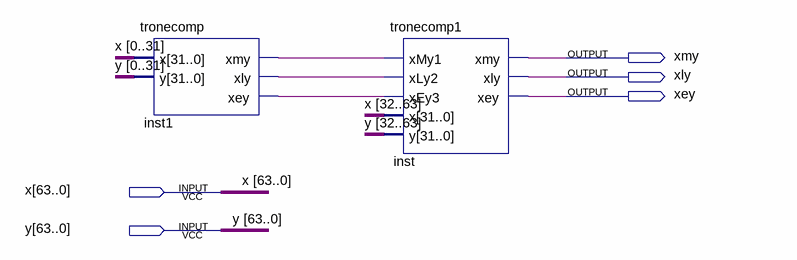
[diagram p0: schematic sheet]
// Quartus schematic hestcetcomp.bdf as structural Verilog: 2 symbols, 5 pins
module hestcetcomp (
  input  [63:0] x,
  input  [63:0] y,
  output xmy,
  output xly,
  output xey
);

  wire inst1_xey, inst1_xly, inst1_xmy;

  tronecomp inst1 (
    .x({x[0], x[1], x[2], x[3], x[4], x[5], x[6], x[7], x[8], x[9], x[10], x[11], x[12], x[13], x[14], x[15], x[16], x[17], x[18], x[19], x[20], x[21], x[22], x[23], x[24], x[25], x[26], x[27], x[28], x[29], x[30], x[31]}),
    .y({y[0], y[1], y[2], y[3], y[4], y[5], y[6], y[7], y[8], y[9], y[10], y[11], y[12], y[13], y[14], y[15], y[16], y[17], y[18], y[19], y[20], y[21], y[22], y[23], y[24], y[25], y[26], y[27], y[28], y[29], y[30], y[31]}),
    .xmy(inst1_xmy), .xly(inst1_xly), .xey(inst1_xey));
  tronecomp1 inst (
    .xMy1(inst1_xmy), .xLy2(inst1_xly), .xEy3(inst1_xey),
    .x({x[32], x[33], x[34], x[35], x[36], x[37], x[38], x[39], x[40], x[41], x[42], x[43], x[44], x[45], x[46], x[47], x[48], x[49], x[50], x[51], x[52], x[53], x[54], x[55], x[56], x[57], x[58], x[59], x[60], x[61], x[62], x[63]}),
    .y({y[32], y[33], y[34], y[35], y[36], y[37], y[38], y[39], y[40], y[41], y[42], y[43], y[44], y[45], y[46], y[47], y[48], y[49], y[50], y[51], y[52], y[53], y[54], y[55], y[56], y[57], y[58], y[59], y[60], y[61], y[62], y[63]}),
    .xmy(xmy), .xly(xly), .xey(xey));
endmodule
